# EAGLE design untitled (EAGLE 9.5.2)
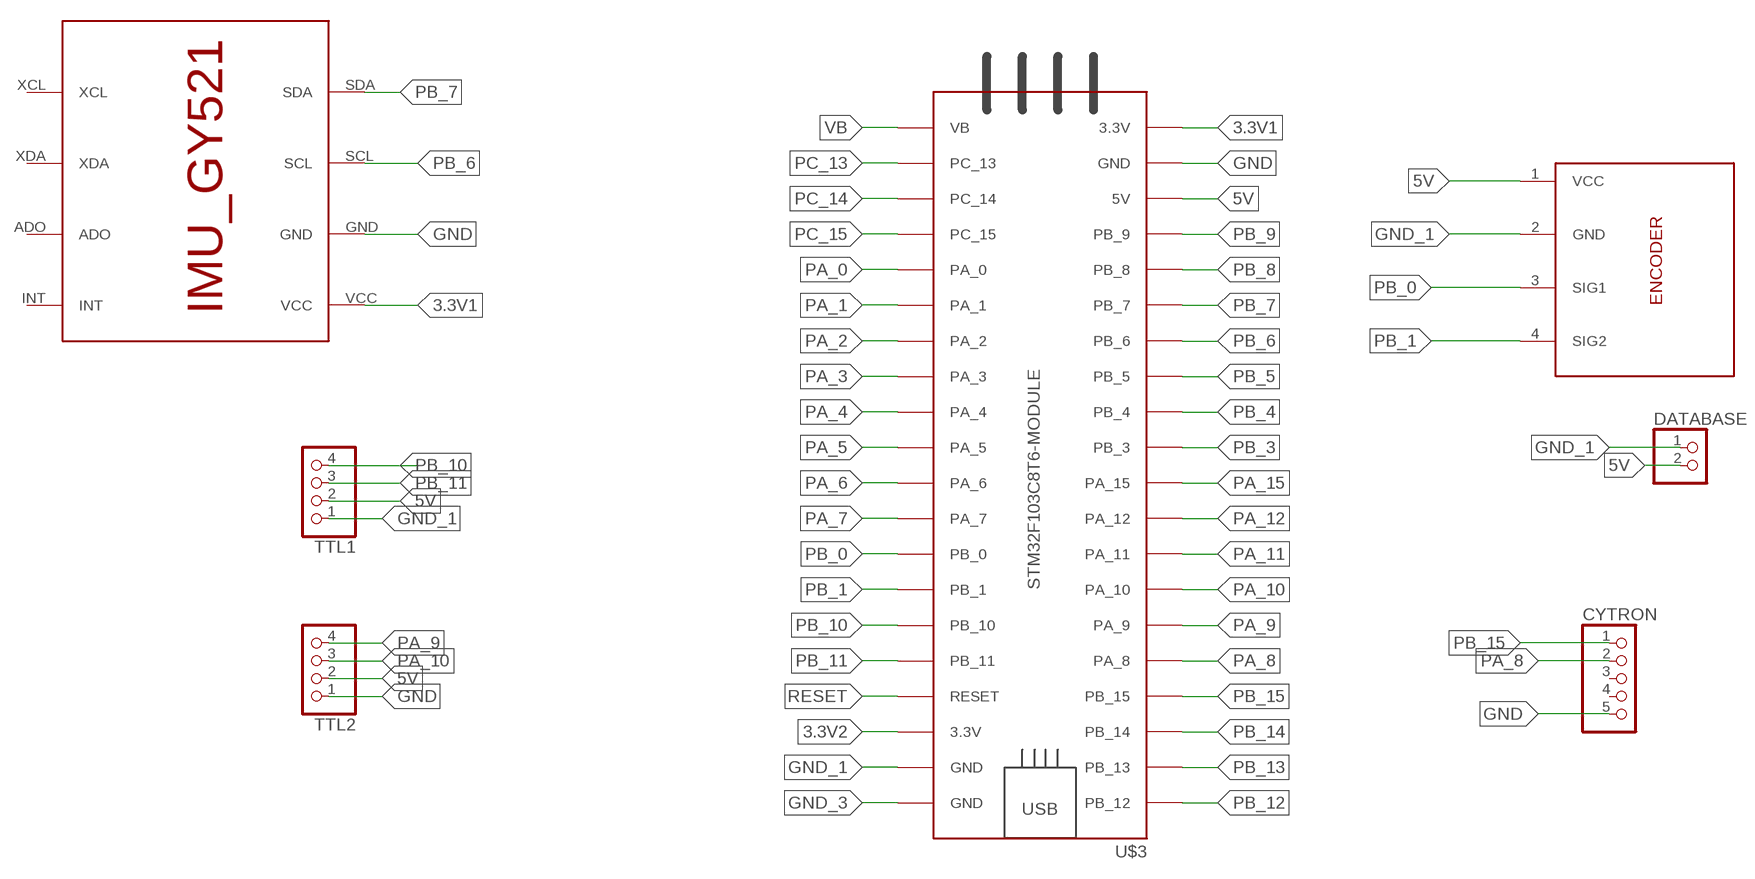
[diagram p0: schematic, sheet 1]

## Parts
CYTRON  PINHD-1X5  [1X05]
DATABASE  PINHD-2_DATA  [1X02_DATA]
TTL1  PINHD-1X4  [1X04]
TTL2  PINHD-1X4  [1X04]
U$1  ENCODER  [1X04_DATA]
U$2  IMU_ROBOCON_GY521  [IMU_GY521]
U$3  STM32F103C8T6-MODULE  [STM32F103C8T6-MODULE]

## Nets
3.3V1: U$2.VCC U$3.3.3V_1(3.3V)
3.3V2: U$3.3.3V_2(3.3V)
5V: DATABASE.2 TTL1.2 TTL2.2 U$1.1(VCC) U$3.5V
GND: CYTRON.5 TTL2.1 U$2.GND U$3.GND_1(GND)
GND_1: DATABASE.1 TTL1.1 U$1.2(GND) U$3.GND_2(GND)
GND_3: U$3.GND_3(GND)
PA_0: U$3.PA_0
PA_1: U$3.PA_1
PA_2: U$3.PA_2
PA_3: U$3.PA_3
PA_4: U$3.PA_4
PA_5: U$3.PA_5
PA_6: U$3.PA_6
PA_7: U$3.PA_7
PA_8: CYTRON.2 U$3.PA_8
PA_9: TTL2.4 U$3.PA_9
PA_10: TTL2.3 U$3.PA_10
PA_11: U$3.PA_11
PA_12: U$3.PA_12
PA_15: U$3.PA_15
PB_0: U$1.3(SIG1) U$3.PB_0
PB_1: U$1.4(SIG2) U$3.PB_1
PB_3: U$3.PB_3
PB_4: U$3.PB_4
PB_5: U$3.PB_5
PB_6: U$2.SCL U$3.PB_6
PB_7: U$2.SDA U$3.PB_7
PB_8: U$3.PB_8
PB_9: U$3.PB_9
PB_10: TTL1.4 U$3.PB_10
PB_11: TTL1.3 U$3.PB_11
PB_12: U$3.PB_12
PB_13: U$3.PB_13
PB_14: U$3.PB_14
PB_15: CYTRON.1 U$3.PB_15
PC_13: U$3.PC_13
PC_14: U$3.PC_14
PC_15: U$3.PC_15
RESET: U$3.RESET
VB: U$3.VB
Unconnected: CYTRON.3 CYTRON.4 U$2.ADO U$2.INT U$2.XCL U$2.XDA

## Library data of the parts
CYTRON = MIA_LIBRARY-2-2-2:PINHD-1X5: PIN HEADER
DATABASE = MIA_LIBRARY-2-2-2:PINHD-2_DATA: PIN HEADER
TTL1 TTL2 = MIA_LIBRARY-2-2-2:PINHD-1X4: PIN HEADER
U$1 = MIA_LIBRARY-2-2-2:ENCODER
U$2 = MIA_LIBRARY-2-2-2:IMU_ROBOCON_GY521
U$3 = MIA_LIBRARY-2-2-2:STM32F103C8T6-MODULE: STM32F103C8T6 module with ARM Cortex-3, 20kB SRAM, 64kB Flash, 72MHz

## Board
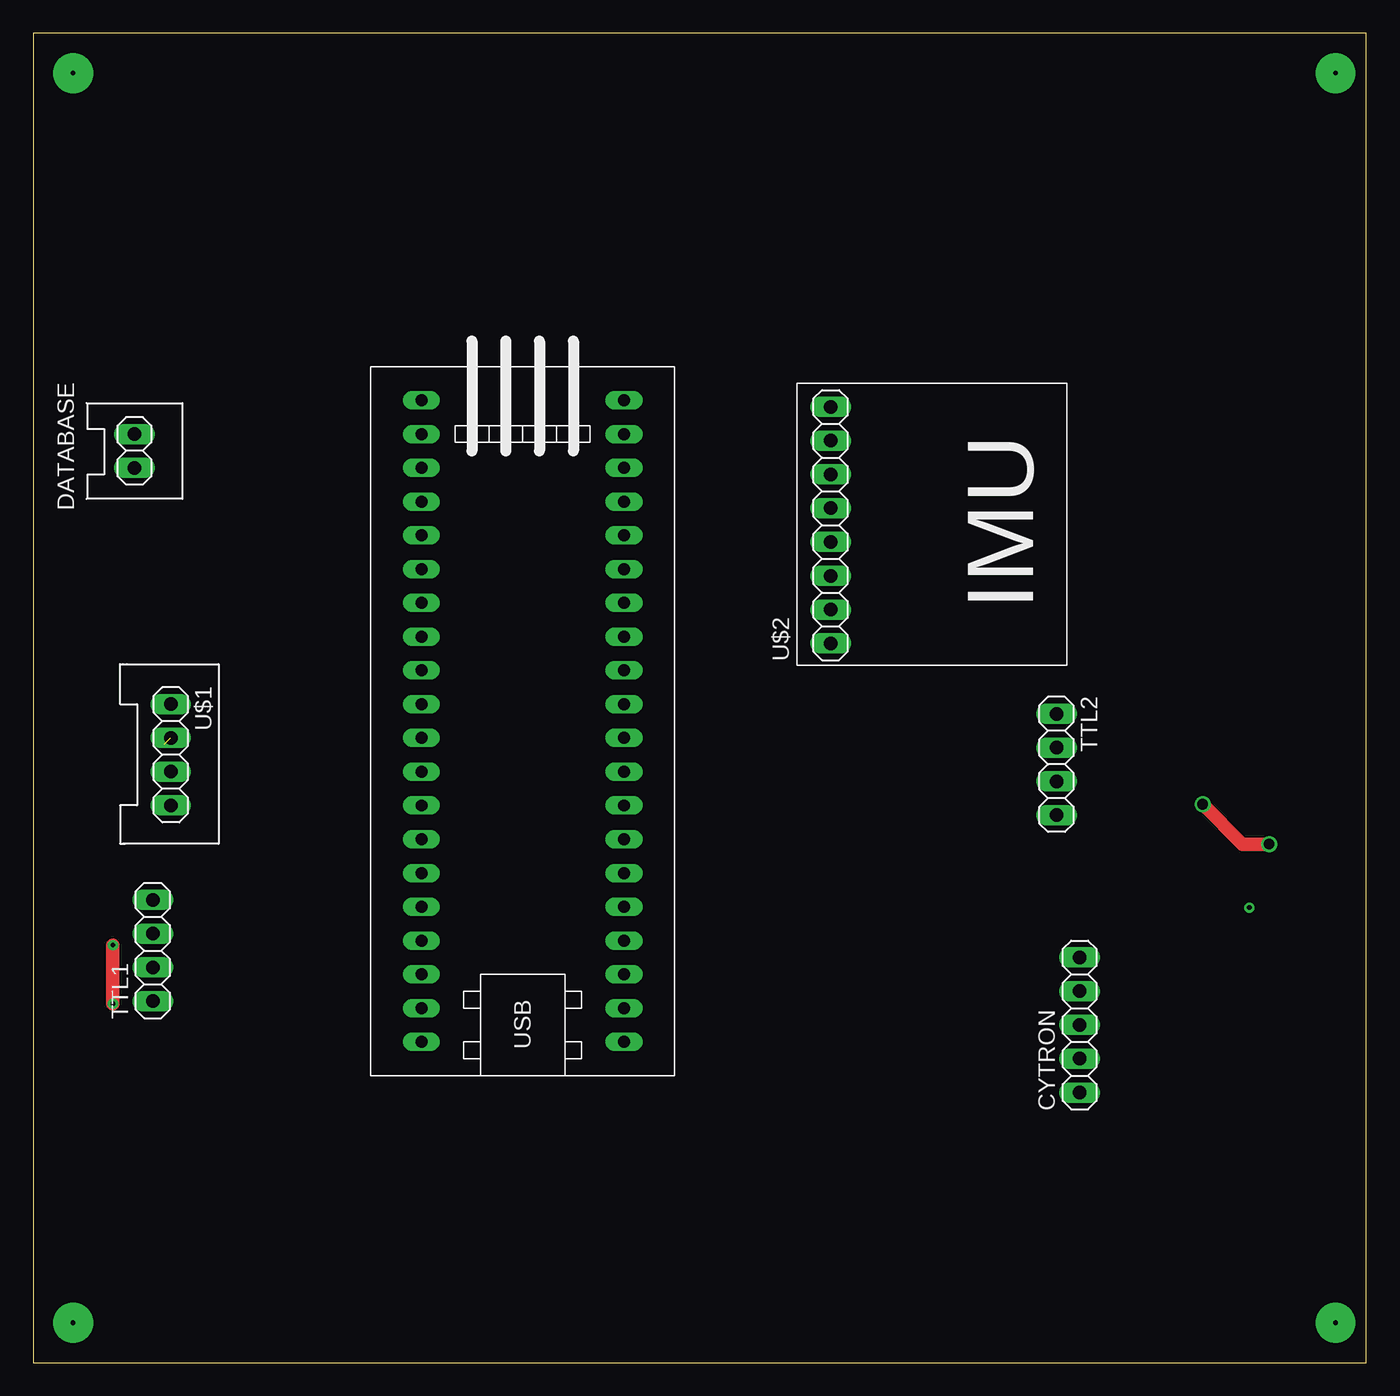
[diagram p1: board, top side]
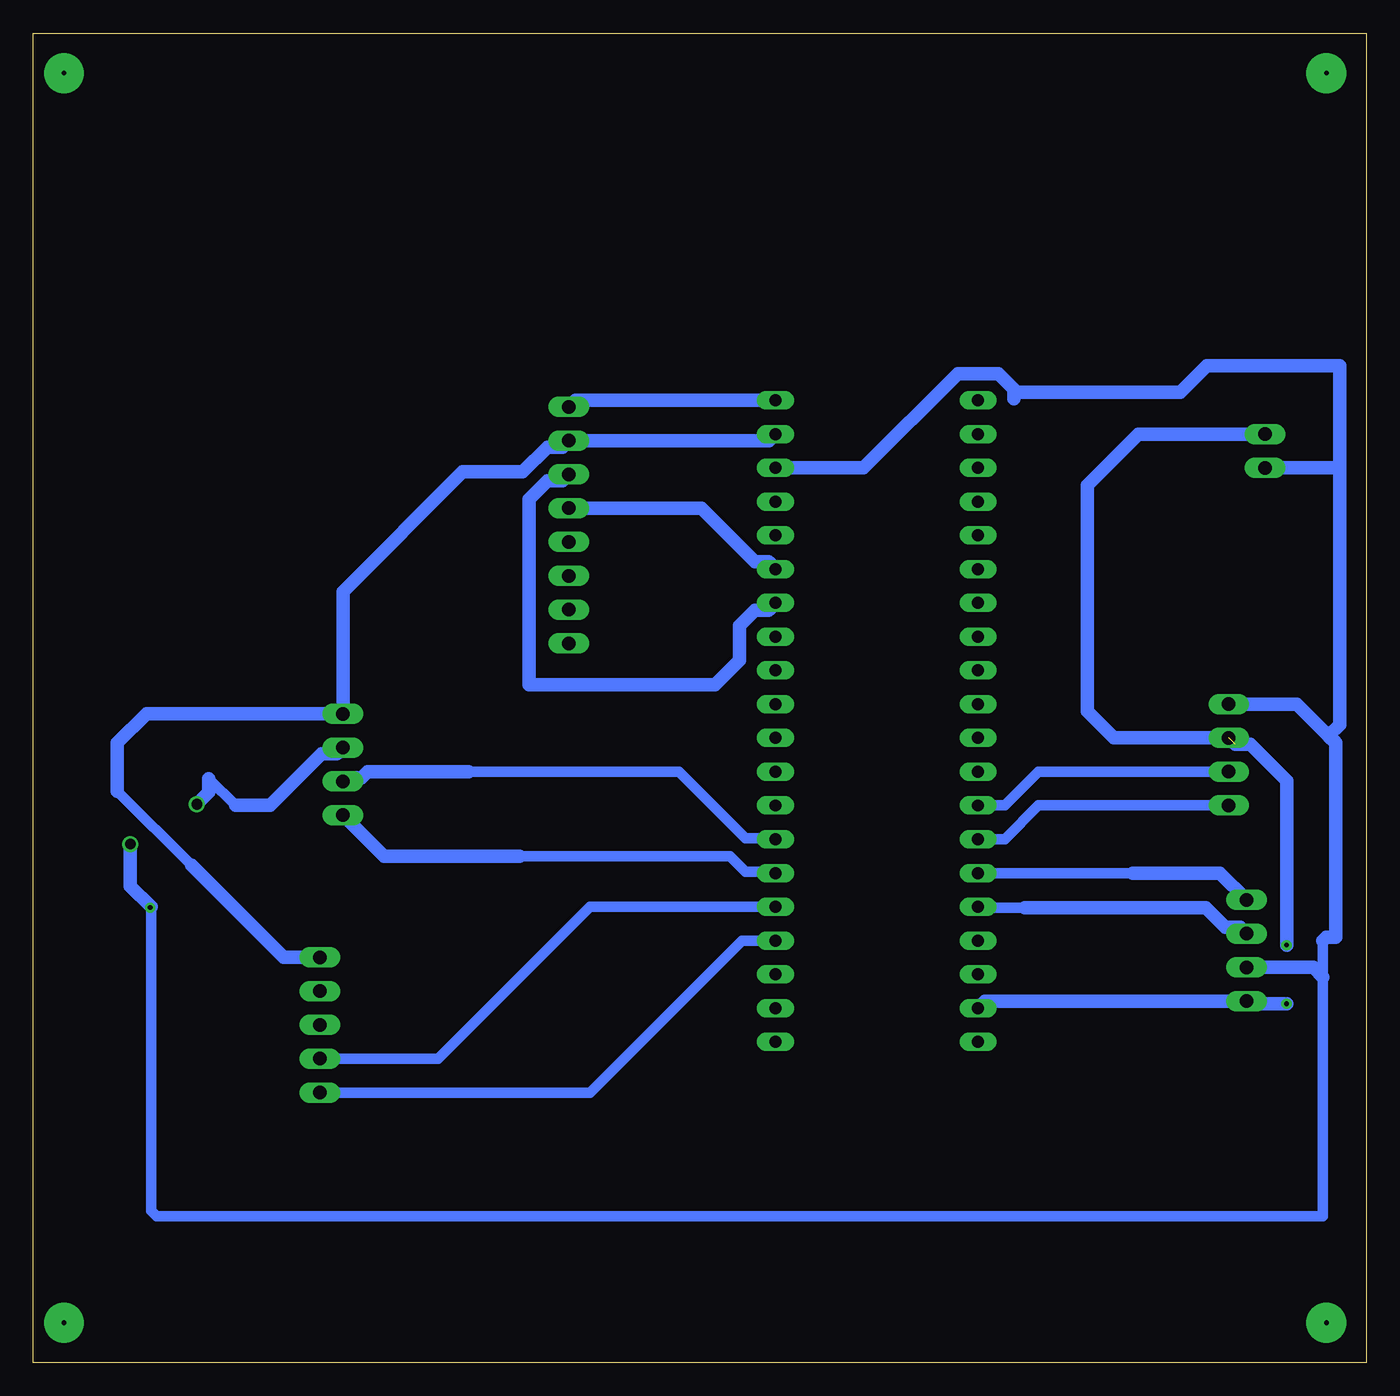
[diagram p2: board, bottom side, seen from below]

Size 100.31 x 100 mm. Coordinates in mm from the lower left corner, seen from the top.
Outline: 0,0 100.31,0 100.31,100 0,100 0,0
Copper layers (1*16): Top 0.035mm / dielectric 1.5mm / Bottom 0.035mm
Design rules "default *": minimum track width 1mm, minimum drill 0.35mm, track to track 0.8mm, track to pad 0.8mm, pad to pad 6mil, via to via 6mil, smd to smd 6mil, copper to edge 0.8mm, drill to drill 6mil, minimum pad ring 10mil, minimum via ring 8mil, stop-mask expansion 4mil, vias tented up to drill 0mil, thermal gap 10mil

### Footprints (pad centres in the part's own frame; a part is rotated, then mirrored left to right if it is on the bottom)
1X05 = drill 1.016 long: 1 -5.08,0; 2 -2.54,0; 3 0,0; 4 2.54,0; 5 5.08,0
1X02_DATA = drill 1.016 long: 1 -1.27,0; 2 1.27,0
1X04 = drill 1.016 long: 1 -3.81,0; 2 -1.27,0; 3 1.27,0; 4 3.81,0
1X04_DATA = drill 1.016 long: 1 -3.81,0; 2 -1.27,0; 3 1.27,0; 4 3.81,0
IMU_GY521 = drill 1.016 long: ADO -6.35,0; GND 6.35,0; INT -8.89,0; SCL 3.81,0; SDA 1.27,0; VCC 8.89,0; XCL -3.81,0; XDA -1.27,0
STM32F103C8T6-MODULE = drill 0.9 long: 3.3V_1 25.4,-7.62; 3.3V_2 -17.78,7.62; 5V 20.32,-7.62; GND_1 22.86,-7.62; GND_2 -20.32,7.62; GND_3 -22.86,7.62; PA_0 15.24,7.62; PA_1 12.7,7.62; PA_2 10.16,7.62; PA_3 7.62,7.62; PA_4 5.08,7.62; PA_5 2.54,7.62; PA_6 0,7.62; PA_7 -2.54,7.62; PA_8 -12.7,-7.62; PA_9 -10.16,-7.62; PA_10 -7.62,-7.62; PA_11 -5.08,-7.62; PA_12 -2.54,-7.62; PA_15 0,-7.62; PB_0 -5.08,7.62; PB_1 -7.62,7.62; PB_3 2.54,-7.62; PB_4 5.08,-7.62; PB_5 7.62,-7.62; PB_6 10.16,-7.62; PB_7 12.7,-7.62; PB_8 15.24,-7.62; PB_9 17.78,-7.62; PB_10 -10.16,7.62; PB_11 -12.7,7.62; PB_12 -22.86,-7.62; PB_13 -20.32,-7.62; PB_14 -17.78,-7.62; PB_15 -15.24,-7.62; PC_13 22.86,7.62; PC_14 20.32,7.62; PC_15 17.78,7.62; RESET -15.24,7.62; VB 25.4,7.62

### Placement (x,y rotation side)
CYTRON  78.74,25.4 90 top
DATABASE  7.62,68.58 270 top
TTL1  9,31 90 top
TTL2  77,45 270 top
U$1  10.35,45.72 270 top
U$2  60,63 90 top
U$3  36.83,46.99 90 top

### Tracks (layer width: path | path; a pad name or v marks a point on that pad's centre or on a via)
3.3V1
  Bottom 1: U$3.3.3V_1 59.5,72.39 U$2.VCC
5V  (via drill 0.35, 0.8)
  Top 1: v88,42 91,39 v93,39
  Bottom 0.8: 87.09,43.91 85.09,41.91 | 3.27,31.73 3.27,29 3.27,11.02 91.03,11.02 91.44,11.43 91.44,34.16 v91.51,34.22 91.44,34.29
  Bottom 1: 87.09,43.91 87.09,42.91 v88,42 | v93,39 93,35.85 91.44,34.29 | U$3.5V 37.83,67.31 30.74,74.39 27.68,74.39 26.5,73.22 26.5,73 | 26.5,73 26.5,72.5 | TTL2.2 77.48,45.79 78.62,45.79 82.5,41.91 85.09,41.91 | U$1.1 5.21,49.53 2.84,47.16 | 2.84,47.16 2.3,46.62 2.3,32 3,32 3.27,31.73 | 26.5,73 14,73 12,75 2,75 2,67 | 2,67 2,48 2.84,47.16 | DATABASE.2 2.31,67.31 2,67 | 3.27,29 4,29.73 TTL1.2
GND
  Bottom 0.8: 93.98,43 88.39,37.4
  Bottom 1: 88.39,37.4 81.46,30.48 CYTRON.5 | U$3.GND_1 44.95,69.35 U$2.GND 60.48,68.87 61.62,68.87 63.49,67 68,67 77,58 TTL2.1 91.79,48.81 93.98,46.62 93.98,43
GND_1  (via drill 0.35)  (1 unrouted)
  Top 1: v6,27 v6,31.41
  Bottom 1: 9.87,46.51 8.73,46.51 6,43.78 v6,31.41 | DATABASE.1 17.15,69.85 21,66 21,49 18.99,46.99 U$1.2 | U$3.GND_2 28.69,27.19 TTL1.1 8.81,27 v6,27
N$1  (via drill 0.35 pad 3)
  other vias: 98,97
N$2  (via drill 0.35 pad 3)
  other vias: 3,97
N$3  (via drill 0.35 pad 3)
  other vias: 98,3
N$4  (via drill 0.35 pad 3)
  other vias: 3,3
PA_8
  Bottom 0.8: U$3.PA_8 58.42,34.29 69.85,22.86 CYTRON.2
PA_9
  Bottom 0.8: U$3.PA_9 44.54,36.92 46.72,36.92 47.9,38.1 63.73,38.1
  Bottom 1: 63.73,38.1 73.91,38.1 TTL2.4
PA_10
  Bottom 0.8: U$3.PA_10 44.54,39.46 46.72,39.46 51.7,44.45 67.53,44.45
  Bottom 1: 67.53,44.45 75.14,44.45 75.6,43.99 76.74,43.99 TTL2.3
PB_0
  Bottom 0.8: U$3.PB_0 27.21,41.91 24.67,44.45 U$1.3
PB_1
  Bottom 0.8: U$3.PB_1 27.21,39.37 24.67,41.91 U$1.4
PB_6
  Bottom 1: U$2.SCL 60.48,66.33 61.62,66.33 63,64.95 63,51 49,51 47.16,52.84 47.16,55.44 45.98,56.61 44.99,56.61 U$3.PB_6
PB_7
  Bottom 1: U$3.PB_7 44.99,60.23 45.98,60.23 50.03,64.27 U$2.SDA
PB_10
  Bottom 0.8: 17.55,36.83 U$3.PB_10
  Bottom 1: TTL1.4 11.02,36.83 17.55,36.83
PB_11
  Bottom 0.8: 25.68,34.2 29.12,34.2 U$3.PB_11
  Bottom 1: TTL1.3 9.48,32.75 10.62,32.75 12.07,34.2 25.68,34.2
PB_15
  Bottom 0.8: U$3.PB_15 46.99,31.75 58.42,20.32 CYTRON.1